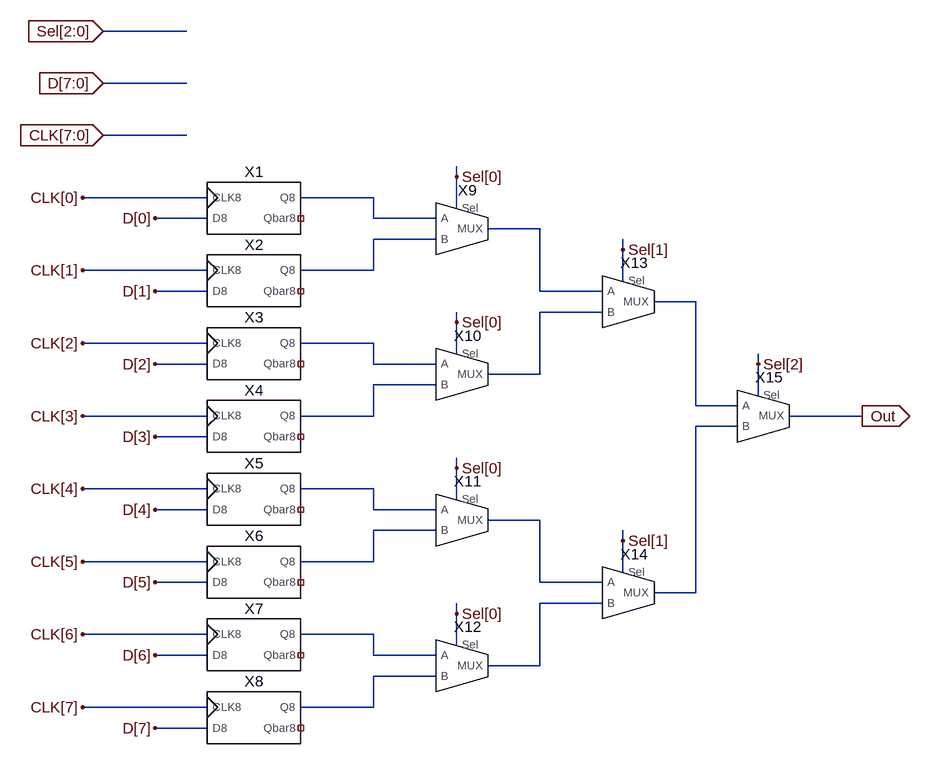
[diagram p0: schematic MysteryCircuit.asc]
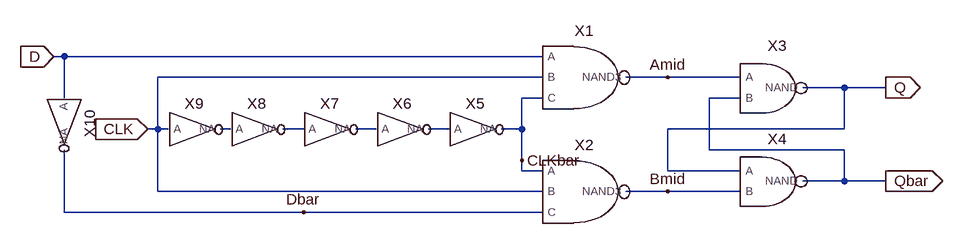
[diagram p1: sub-circuit dff.asc]
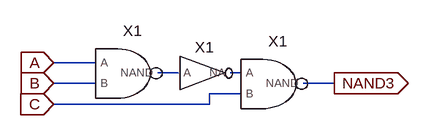
[diagram p2: sub-circuit nand3.asc]
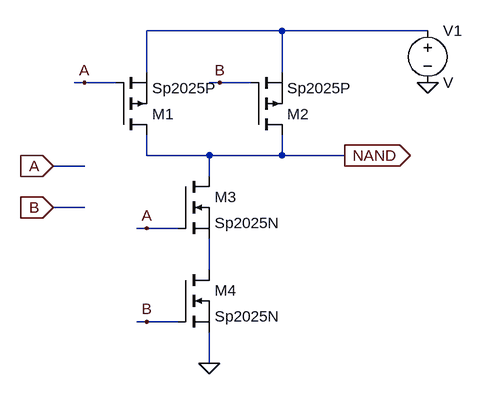
[diagram p3: sub-circuit nand.asc]
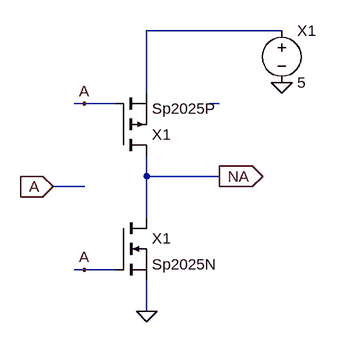
[diagram p4: sub-circuit invert.asc]
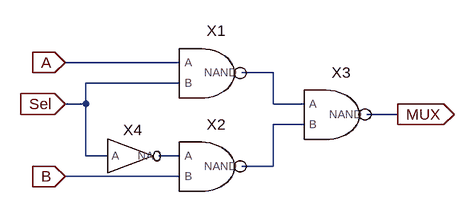
[diagram p5: sub-circuit mux.asc]
MysteryCircuit.asc, the LTspice schematic file:
Version 4.1
SHEET 1 1044 936
WIRE -96 -208 -224 -208
WIRE -96 -128 -224 -128
WIRE -96 -48 -224 -48
WIRE 320 16 320 0
WIRE -64 48 -256 48
WIRE 192 48 80 48
WIRE 320 64 320 16
WIRE -64 80 -144 80
WIRE 192 80 192 48
WIRE 288 80 192 80
WIRE 448 96 368 96
WIRE 288 112 192 112
WIRE 576 128 576 112
WIRE -64 160 -256 160
WIRE 192 160 192 112
WIRE 192 160 80 160
WIRE 576 176 576 128
WIRE -64 192 -144 192
WIRE 448 192 448 96
WIRE 544 192 448 192
WIRE 688 208 624 208
WIRE 544 224 448 224
WIRE 320 240 320 224
WIRE -64 272 -256 272
WIRE 192 272 80 272
WIRE 320 288 320 240
WIRE -64 304 -144 304
WIRE 192 304 192 272
WIRE 288 304 192 304
WIRE 784 304 784 288
WIRE 448 320 448 224
WIRE 448 320 368 320
WIRE 288 336 192 336
WIRE 784 352 784 304
WIRE 688 368 688 208
WIRE 752 368 688 368
WIRE -64 384 -256 384
WIRE 192 384 192 336
WIRE 192 384 80 384
WIRE 944 384 832 384
WIRE 752 400 688 400
WIRE -64 416 -144 416
WIRE 320 464 320 448
WIRE -64 496 -256 496
WIRE 192 496 80 496
WIRE 320 512 320 464
WIRE -64 528 -144 528
WIRE 192 528 192 496
WIRE 288 528 192 528
WIRE 448 544 368 544
WIRE 288 560 192 560
WIRE 576 576 576 560
WIRE -64 608 -256 608
WIRE 192 608 192 560
WIRE 192 608 80 608
WIRE 576 624 576 576
WIRE -64 640 -144 640
WIRE 448 640 448 544
WIRE 544 640 448 640
WIRE 688 656 688 400
WIRE 688 656 624 656
WIRE 544 672 448 672
WIRE 320 688 320 672
WIRE -64 720 -256 720
WIRE 192 720 80 720
WIRE 320 736 320 688
WIRE -64 752 -144 752
WIRE 192 752 192 720
WIRE 288 752 192 752
WIRE 448 768 448 672
WIRE 448 768 368 768
WIRE 288 784 192 784
WIRE -64 832 -256 832
WIRE 192 832 192 784
WIRE 192 832 80 832
WIRE -64 864 -144 864
FLAG -144 80 D[0]
FLAG -256 48 CLK[0]
FLAG -144 192 D[1]
FLAG -144 304 D[2]
FLAG -144 416 D[3]
FLAG -144 528 D[4]
FLAG -144 640 D[5]
FLAG -144 752 D[6]
FLAG -144 864 D[7]
FLAG 320 16 Sel[0]
FLAG 320 240 Sel[0]
FLAG 320 464 Sel[0]
FLAG 320 688 Sel[0]
FLAG 576 128 Sel[1]
FLAG 576 576 Sel[1]
FLAG 784 304 Sel[2]
FLAG -224 -48 CLK[7:0]
IOPIN -224 -48 In
FLAG 944 384 Out
IOPIN 944 384 Out
FLAG -256 160 CLK[1]
FLAG -256 272 CLK[2]
FLAG -256 384 CLK[3]
FLAG -256 496 CLK[4]
FLAG -256 608 CLK[5]
FLAG -256 720 CLK[6]
FLAG -256 832 CLK[7]
FLAG -224 -128 D[7:0]
IOPIN -224 -128 In
FLAG -224 -208 Sel[2:0]
IOPIN -224 -208 In
SYMBOL dff 0 64 R0
SYMATTR InstName X1
SYMBOL dff 0 176 R0
SYMATTR InstName X2
SYMBOL dff 0 288 R0
SYMATTR InstName X3
SYMBOL dff 0 400 R0
SYMATTR InstName X4
SYMBOL dff 0 512 R0
SYMATTR InstName X5
SYMBOL dff 0 624 R0
SYMATTR InstName X6
SYMBOL dff 0 736 R0
SYMATTR InstName X7
SYMBOL dff 0 848 R0
SYMATTR InstName X8
SYMBOL MUX 352 80 R0
SYMATTR InstName X9
SYMBOL MUX 352 304 R0
SYMATTR InstName X10
SYMBOL MUX 352 528 R0
SYMATTR InstName X11
SYMBOL MUX 352 752 R0
SYMATTR InstName X12
SYMBOL MUX 608 192 R0
SYMATTR InstName X13
SYMBOL MUX 608 640 R0
SYMATTR InstName X14
SYMBOL MUX 816 368 R0
SYMATTR InstName X15

dff.asc, the sub-circuit schematic file:
Version 4.1
SHEET 1 880 680
WIRE -592 64 -608 64
WIRE 144 64 -592 64
WIRE 144 96 -448 96
WIRE 336 96 272 96
WIRE 448 96 336 96
WIRE 608 112 544 112
WIRE 672 112 608 112
WIRE -592 128 -592 64
WIRE 144 128 112 128
WIRE 448 128 400 128
WIRE -448 176 -448 96
WIRE -448 176 -464 176
WIRE -432 176 -448 176
WIRE -336 176 -352 176
WIRE -224 176 -256 176
WIRE -112 176 -144 176
WIRE 0 176 -32 176
WIRE 112 176 112 128
WIRE 112 176 80 176
WIRE 608 176 608 112
WIRE 608 176 336 176
WIRE 400 208 400 128
WIRE 608 208 400 208
WIRE 112 224 112 176
WIRE 112 240 112 224
WIRE 144 240 112 240
WIRE 336 240 336 176
WIRE 448 240 336 240
WIRE 608 256 608 208
WIRE 608 256 544 256
WIRE 672 256 608 256
WIRE -448 272 -448 176
WIRE 144 272 -448 272
WIRE 336 272 272 272
WIRE 448 272 336 272
WIRE -592 304 -592 208
WIRE -224 304 -592 304
WIRE 144 304 -224 304
FLAG -608 64 D
IOPIN -608 64 In
FLAG -464 176 CLK
IOPIN -464 176 In
FLAG 672 112 Q
IOPIN 672 112 Out
FLAG 672 256 Qbar
IOPIN 672 256 Out
FLAG -224 304 Dbar
FLAG 336 96 Amid
FLAG 336 272 Bmid
FLAG 112 224 CLKbar
SYMBOL NAND3 208 96 R0
SYMATTR InstName X1
SYMBOL NAND3 208 272 R0
SYMATTR InstName X2
SYMBOL INVERT 32 176 R0
SYMATTR InstName X5
SYMBOL INVERT -80 176 R0
SYMATTR InstName X6
SYMBOL INVERT -192 176 R0
SYMATTR InstName X7
SYMBOL INVERT -304 176 R0
SYMATTR InstName X8
SYMBOL INVERT -400 176 R0
SYMATTR InstName X9
SYMBOL NAND 496 112 R0
SYMATTR InstName X3
SYMBOL NAND 496 256 R0
SYMATTR InstName X4
SYMBOL INVERT -592 160 R90
SYMATTR InstName X10

nand3.asc, the sub-circuit schematic file:
Version 4
SHEET 1 880 680
WIRE 80 80 16 80
WIRE 208 96 176 96
WIRE 304 96 288 96
WIRE 80 112 16 112
WIRE 448 112 400 112
WIRE 304 128 256 128
WIRE 256 144 256 128
WIRE 256 144 16 144
FLAG 16 80 A
IOPIN 16 80 In
FLAG 16 112 B
IOPIN 16 112 In
FLAG 16 144 C
IOPIN 16 144 In
FLAG 448 112 NAND3
IOPIN 448 112 Out
SYMBOL NAND 128 96 R0
SYMATTR InstName X1
SYMBOL NAND 352 112 R0
SYMATTR InstName X1
SYMBOL INVERT 240 96 R0
SYMATTR InstName X1

nand.asc, the sub-circuit schematic file:
Version 4
SHEET 1 880 680
.lib SHEET 1 880 680
WIRE 336 -160 128 -160
WIRE 560 -160 336 -160
WIRE 128 -96 128 -160
WIRE 336 -96 336 -160
WIRE 32 -80 16 -80
WIRE 80 -80 32 -80
WIRE 240 -80 224 -80
WIRE 288 -80 240 -80
WIRE 128 32 128 0
WIRE 224 32 128 32
WIRE 336 32 336 0
WIRE 336 32 224 32
WIRE 432 32 336 32
WIRE 32 48 -16 48
WIRE 224 64 224 32
WIRE 32 112 -16 112
WIRE 128 144 112 144
WIRE 176 144 128 144
WIRE 224 208 224 160
WIRE 128 288 112 288
WIRE 176 288 128 288
WIRE 224 352 224 304
FLAG 224 352 0
FLAG -16 48 A
IOPIN -16 48 In
FLAG -16 112 B
IOPIN -16 112 In
FLAG 128 144 A
FLAG 128 288 B
FLAG 32 -80 A
FLAG 240 -80 B
FLAG 432 32 NAND
IOPIN 432 32 Out
FLAG 560 -80 0
SYMBOL pmos 80 0 M180
SYMATTR InstName M1
SYMATTR Value Sp2025P
SYMBOL pmos 288 0 M180
SYMATTR InstName M2
SYMATTR Value Sp2025P
SYMBOL nmos 176 64 R0
SYMATTR InstName M3
SYMATTR Value Sp2025N
SYMBOL nmos 176 208 R0
SYMATTR InstName M4
SYMATTR Value Sp2025N
SYMBOL voltage 560 -176 R0
SYMATTR InstName V1

invert.asc, the sub-circuit schematic file:
Version 4
SHEET 1 880 680
WIRE 352 -80 144 -80
WIRE 144 16 144 -80
WIRE 48 32 32 32
WIRE 96 32 48 32
WIRE 256 32 240 32
WIRE 144 144 144 112
WIRE 256 144 144 144
WIRE 48 160 0 160
WIRE 144 208 144 144
WIRE 48 288 32 288
WIRE 96 288 48 288
WIRE 144 352 144 304
FLAG 144 352 0
FLAG 0 160 A
IOPIN 0 160 In
FLAG 48 288 A
FLAG 48 32 A
FLAG 256 144 NA
IOPIN 256 144 Out
FLAG 352 0 0
SYMBOL pmos 96 112 M180
SYMATTR InstName X1
SYMATTR Value Sp2025P
SYMBOL nmos 96 208 R0
SYMATTR InstName X1
SYMATTR Value Sp2025N
SYMBOL voltage 352 -96 R0
SYMATTR InstName X1
SYMATTR Value 5

mux.asc, the sub-circuit schematic file:
Version 4
SHEET 1 880 680
WIRE 96 80 -80 80
WIRE 240 96 192 96
WIRE 96 112 -48 112
WIRE -48 144 -48 112
WIRE -48 144 -80 144
WIRE 240 144 240 96
WIRE 288 144 240 144
WIRE 432 160 384 160
WIRE 288 176 240 176
WIRE -48 224 -48 144
WIRE -16 224 -48 224
WIRE 96 224 64 224
WIRE 240 240 240 176
WIRE 240 240 192 240
WIRE 96 256 -80 256
FLAG 432 160 MUX
IOPIN 432 160 Out
FLAG -80 80 A
IOPIN -80 80 In
FLAG -80 256 B
IOPIN -80 256 In
FLAG -80 144 Sel
IOPIN -80 144 In
SYMBOL NAND 144 96 R0
SYMATTR InstName X1
SYMBOL NAND 144 240 R0
SYMATTR InstName X2
SYMBOL NAND 336 160 R0
SYMATTR InstName X3
SYMBOL INVERT 16 224 R0
SYMATTR InstName X4

The netlist it stands for:
* MysteryCircuit.asc
X§X1 CLK[0] D[0] N001 NC_01 dff
X§X2 CLK[1] D[1] N003 NC_02 dff
X§X3 CLK[2] D[2] N006 NC_03 dff
X§X4 CLK[3] D[3] N007 NC_04 dff
X§X5 CLK[4] D[4] N009 NC_05 dff
X§X6 CLK[5] D[5] N011 NC_06 dff
X§X7 CLK[6] D[6] N013 NC_07 dff
X§X8 CLK[7] D[7] N014 NC_08 dff
X§X9 N001 N003 Sel[0] N002 mux
X§X10 N006 N007 Sel[0] N005 mux
X§X11 N009 N011 Sel[0] N010 mux
X§X12 N013 N014 Sel[0] N012 mux
X§X13 N002 N005 Sel[1] N004 mux
X§X14 N010 N012 Sel[1] N008 mux
X§X15 N004 N008 Sel[2] Out mux

* block symbol definitions
.subckt dff CLK8 D8 Q8 Qbar8
X§X1 D CLK CLKbar Amid nand3
X§X2 CLKbar CLK Dbar Bmid nand3
X§X5 N004 CLKbar invert
X§X6 N003 N004 invert
X§X7 N002 N003 invert
X§X8 N001 N002 invert
X§X9 CLK N001 invert
X§X3 Amid Qbar Q nand
X§X4 Q Bmid Qbar nand
X§X10 D Dbar invert
.ends dff

.subckt nand3 A B C NAND3
XX1 A B N001 nand
XX1 N002 C NAND3 nand
XX1 N001 N002 invert
.ends nand3

.subckt nand A B NAND
M1 NAND A N001 N001 Sp2025P
M2 NAND B N001 N001 Sp2025P
M3 NAND A N002 N002 Sp2025N
M4 N002 B 0 0 Sp2025N
V1 N001 0 V
.ends nand

.subckt invert A NA
M§X1 NA A N001 N001 Sp2025P
M§X1 NA A 0 0 Sp2025N
V§X1 N001 0 5
.ends invert

.subckt mux A B Sel MUX
XX1 A Sel N001 nand
XX2 N003 B N002 nand
XX3 N001 N002 MUX nand
XX4 Sel N003 invert
.ends mux

.model NMOS NMOS
.model PMOS PMOS
.lib standard.mos
.backanno
.end